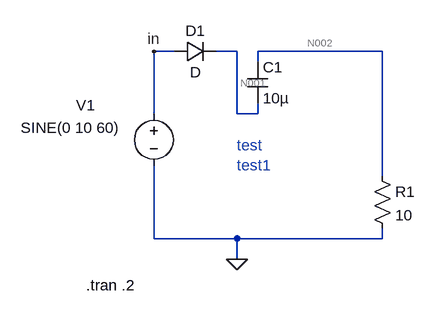
[diagram p0: schematic 01_basics.asc]
01_basics.asc, the LTspice schematic file:
Version 4
SHEET 1 880 680
WIRE 0 -32 -32 -32
WIRE 96 -32 64 -32
WIRE 320 -32 128 -32
WIRE 128 -16 128 -32
WIRE -32 64 -32 -32
WIRE 96 64 96 -32
WIRE 128 64 128 48
WIRE 128 64 96 64
WIRE 320 160 320 -32
WIRE -32 256 -32 144
WIRE 96 256 -32 256
WIRE 320 256 320 240
WIRE 320 256 96 256
WIRE 96 288 96 256
FLAG 96 288 0
FLAG -32 -32 in
SYMBOL voltage -32 48 R0
WINDOW 0 -120 3 Left 2
WINDOW 3 -205 37 Left 2
WINDOW 123 0 0 Left 0
WINDOW 39 0 0 Left 0
SYMATTR InstName V1
SYMATTR Value SINE(0 10 60)
SYMBOL cap 112 -16 R0
SYMATTR InstName C1
SYMATTR Value 10µ
SYMBOL diode 0 -16 R270
WINDOW 0 32 32 VTop 2
WINDOW 3 0 32 VBottom 2
SYMATTR InstName D1
SYMBOL res 304 144 R0
SYMATTR InstName R1
SYMATTR Value 10
TEXT -136 328 Left 2 !.tran .2
TEXT 96 112 Left 2 ;test\ntest1

The netlist it stands for:
* 01_basics.asc
V1 in 0 SINE(0 10 60)
C1 N002 N001 10µ
D1 in N001 D
R1 N002 0 10
.model D D
.lib standard.dio
.tran .2
* test
* test1
.backanno
.end

* Results of the author's LTspice run, read from the files saved beside the schematic
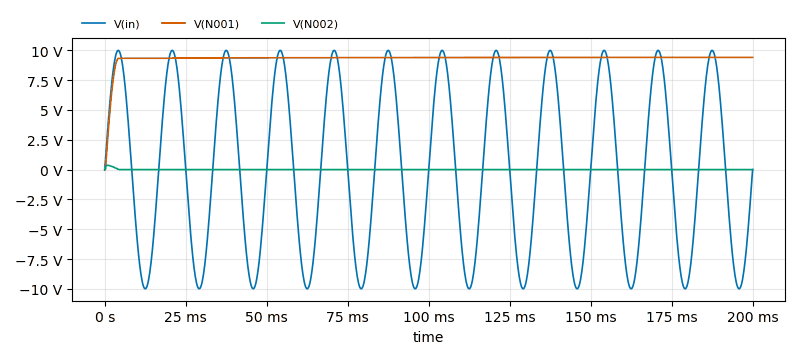
[diagram p1: Transient Analysis of 01_basics.asc, plotted from the saved traces]
* Transient Analysis, 1 run:
*   V(in): min -10 V, max 10 V, average 1.195 µV, rms 7.071 V, last 0 V
*   V(N001): min 0 V, max 9.414 V, average 9.31 V, rms 9.336 V, last 9.414 V
*   V(N002): min 0 V, max 361.7 mV, average 4.692 mV, rms 35.99 mV, last 0 V